# EAGLE design lcd22 (EAGLE 9.6.2)
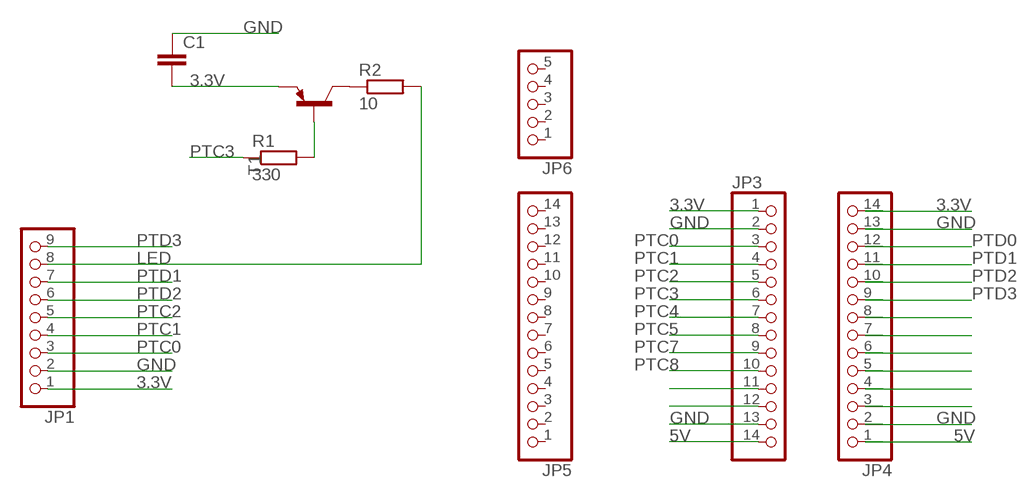
[diagram p0: schematic, sheet 1]

## Parts
C1  C-EU025-025X050  [C025-025X050]
JP1  PINHD-1X9  [1X09]
JP3  PINHD-1X14  [1X14]
JP4  PINHD-1X14  [1X14]
JP5  PINHD-1X14  [1X14]
JP6  PINHD-1X5  [1X05]
R1  330  R-EU_0207/10  [0207/10]
R2  10  R-EU_0207/10  [0207/10]
T1  BC557C-PNP-TO92-EBC  [TO92-EBC]

## Nets
3.3V: C1.2 JP1.1 JP3.1 JP4.14 T1.E
5V: JP3.14 JP4.1
GND: C1.1 JP1.2 JP3.2 JP3.13 JP4.2 JP4.13
LED: JP1.8 R2.2
N$1: R1.2 T1.B
N$3: R2.1 T1.C
N$42: JP3.11
N$43: JP3.12
N$50: JP4.8
N$51: JP4.7
N$52: JP4.6
N$53: JP4.5
N$57: JP4.4
N$58: JP4.3
PTC0: JP1.3 JP3.3
PTC1: JP1.4 JP3.4
PTC2: JP1.5 JP3.5
PTC3: JP3.6 R1.1
PTC4: JP3.7
PTC5: JP3.8
PTC7: JP3.9
PTC8: JP3.10
PTD0: JP4.12
PTD1: JP1.7 JP4.11
PTD2: JP1.6 JP4.10
PTD3: JP1.9 JP4.9
Unconnected: JP5.1 JP5.2 JP5.3 JP5.4 JP5.5 JP5.6 JP5.7 JP5.8 JP5.9 JP5.10 JP5.11 JP5.12 JP5.13 JP5.14 JP6.1 JP6.2 JP6.3 JP6.4 JP6.5

## Library data of the parts
C1 = resistor:C-EU: CAPACITOR, European symbol
JP1 = pinhead:PINHD-1X9: PIN HEADER
JP3-JP5 = pinhead:PINHD-1X14: PIN HEADER
JP6 = pinhead:PINHD-1X5: PIN HEADER
R1 R2 = resistor:R-EU_: RESISTOR, European symbol
T1 = transistor:*-PNP-: PNP Transistror

## Net classes
0 default: width 0.406 mm, drill 0.8 mm

## Board
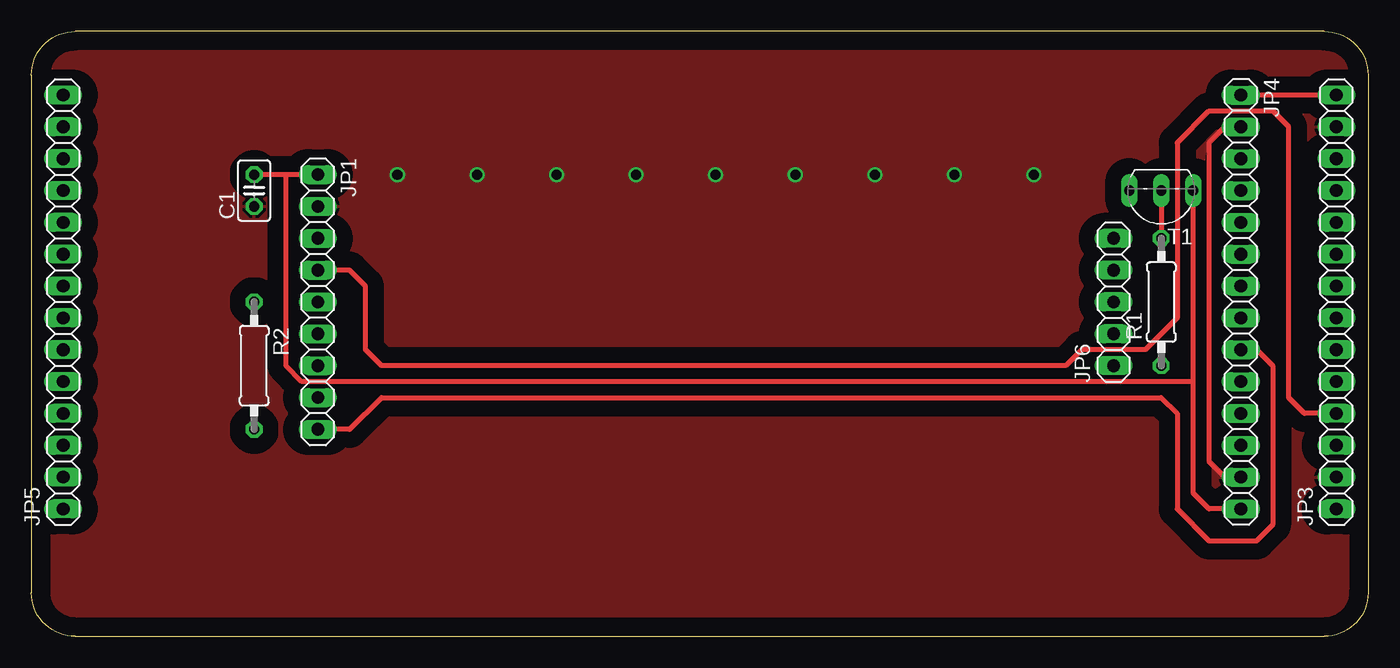
[diagram p1: board, top side]
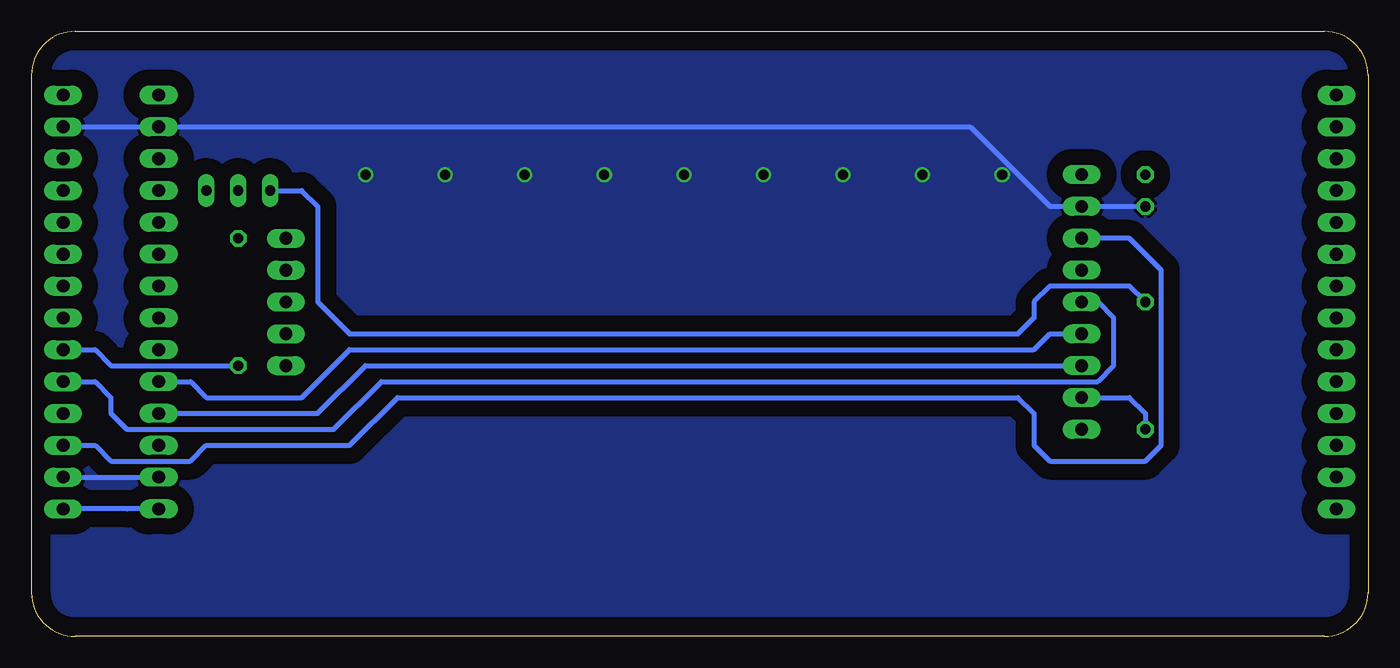
[diagram p2: board, bottom side, seen from below]

Size 106.68 x 48.26 mm. Coordinates in mm from the lower left corner, seen from the top.
Outline: 3.49,0 103.19,0 arc90 106.68,3.49 106.68,44.77 arc90 103.19,48.26 3.49,48.26 arc90 0,44.77 0,3.49 arc90 3.49,0
Copper layers (1*16): Top 0.035mm / dielectric 1.5mm / Bottom 0.035mm
Design rules "default *": minimum track width 10mil, minimum drill 24mil, track to track 8mil, track to pad 8mil, pad to pad 8mil, via to via 8mil, smd to smd 8mil, copper to edge 60mil, drill to drill 8mil, minimum pad ring 10mil, minimum via ring 8mil, stop-mask expansion 4mil, vias tented up to drill 0mil, thermal gap 10mil

### Footprints (pad centres in the part's own frame; a part is rotated, then mirrored left to right if it is on the bottom)
C025-025X050 = drill 0.813 octagon: 1 -1.27,0; 2 1.27,0
1X09 = drill 1.016 long: 1 -10.16,0; 2 -7.62,0; 3 -5.08,0; 4 -2.54,0; 5 0,0; 6 2.54,0; 7 5.08,0; 8 7.62,0; 9 10.16,0
1X14 = drill 1.016 long: 1 -16.51,0; 2 -13.97,0; 3 -11.43,0; 4 -8.89,0; 5 -6.35,0; 6 -3.81,0; 7 -1.27,0; 8 1.27,0; 9 3.81,0; 10 6.35,0; 11 8.89,0; 12 11.43,0; 13 13.97,0; 14 16.51,0
1X05 = drill 1.016 long: 1 -5.08,0; 2 -2.54,0; 3 0,0; 4 2.54,0; 5 5.08,0
0207/10 = drill 0.813 octagon: 1 -5.08,0; 2 5.08,0
TO92-EBC = drill 0.813 long: B 0,-1.27; C 2.54,-1.27; E -2.54,-1.27

### Placement (x,y rotation side)
C1  17.78,35.56 90 top
JP1  22.86,26.67 270 top
JP3  104.14,26.67 90 top
JP4  96.52,26.67 270 top
JP5  2.54,26.67 90 top
JP6  86.36,26.67 90 top
R1  90.17,26.67 90 top
R2  17.78,21.59 270 top
T1  90.17,34.29 180 top

### Tracks (layer width: path | path; a pad name or v marks a point on that pad's centre or on a via)
3.3V
  Top 0.406: JP1.1 20.32,36.83 | 20.32,36.83 C1.2 | 92.71,20.32 92.71,11.43 93.98,10.16 JP4.14 | 92.71,20.32 T1.E | 20.32,36.83 20.32,21.59 21.59,20.32 92.71,20.32
  Bottom 0.406: JP4.14 99.06,10.16 | 99.06,10.16 JP3.1 | 99.06,10.16
5V
  Top 0.406: JP3.14 JP4.1
GND  (via drill 0.8)
  Top 0.406: JP4.13 95.25,12.7 93.98,13.97 93.98,39.37 95.25,40.64 JP4.2
  Bottom 0.406: JP3.2 JP4.13 | C1.1 JP1.2 25.4,34.29 31.75,40.64 JP4.2 JP3.13
  other vias: 29.21,36.83 35.56,36.83 41.91,36.83 48.26,36.83 54.61,36.83 60.96,36.83 67.31,36.83 73.66,36.83 80.01,36.83
  pour Top (isolate 1.27): -1.27,49.53 107.95,49.53 107.95,-1.27 -1.27,-1.27
  pour Bottom (isolate 1.27): -2.54,50.8 109.22,50.8 109.22,-2.54 -2.54,-2.54
LED
  Bottom 0.406: R2.2 17.78,17.78 19.05,19.05 JP1.8
N$1
  Top 0.406: T1.B R1.2
N$3
  Bottom 0.406: R2.1 19.05,27.94 25.4,27.94 26.67,26.67 26.67,25.4 27.94,24.13 81.28,24.13 83.82,26.67 83.82,34.29 85.09,35.56 T1.C
PTC0
  Bottom 0.406: JP1.3 19.05,31.75 16.51,29.21 16.51,15.24 17.78,13.97 25.4,13.97 26.67,15.24 26.67,17.78 27.94,19.05 77.47,19.05 81.28,15.24 92.71,15.24 93.98,13.97 100.33,13.97 101.6,15.24 JP3.3
PTC1
  Top 0.406: JP1.4 25.4,29.21 26.67,27.94 26.67,22.86 27.94,21.59 82.55,21.59 83.82,22.86 88.9,22.86 91.44,25.4 91.44,39.37 93.98,41.91 99.06,41.91 100.33,40.64 100.33,19.05 101.6,17.78 JP3.4
PTC2
  Bottom 0.406: JP1.5 21.59,26.67 20.32,25.4 20.32,21.59 21.59,20.32 78.74,20.32 82.55,16.51 99.06,16.51 100.33,17.78 100.33,19.05 101.6,20.32 JP3.5
PTC3
  Bottom 0.406: R1.1 100.33,21.59 101.6,22.86 JP3.6
PTD1
  Bottom 0.406: JP1.7 80.01,21.59 83.82,17.78 JP4.11
PTD2
  Bottom 0.406: JP1.6 25.4,24.13 26.67,22.86 81.28,22.86 85.09,19.05 92.71,19.05 93.98,20.32 JP4.10
PTD3
  Top 0.406: JP1.9 25.4,16.51 27.94,19.05 90.17,19.05 91.44,17.78 91.44,10.16 93.98,7.62 97.79,7.62 99.06,8.89 99.06,21.59 97.79,22.86 JP4.9

### Text on the board
tStop: LCD Modul v2 2020 / petr.olivka@vsb.cz / david.seidl@vsb.cz
HorniPopis: LCD 2.2" 320x240 / Driver ILI9341